# Altium schematic sheet OSV-OL_MOT-DRIV.SchDoc
size A3
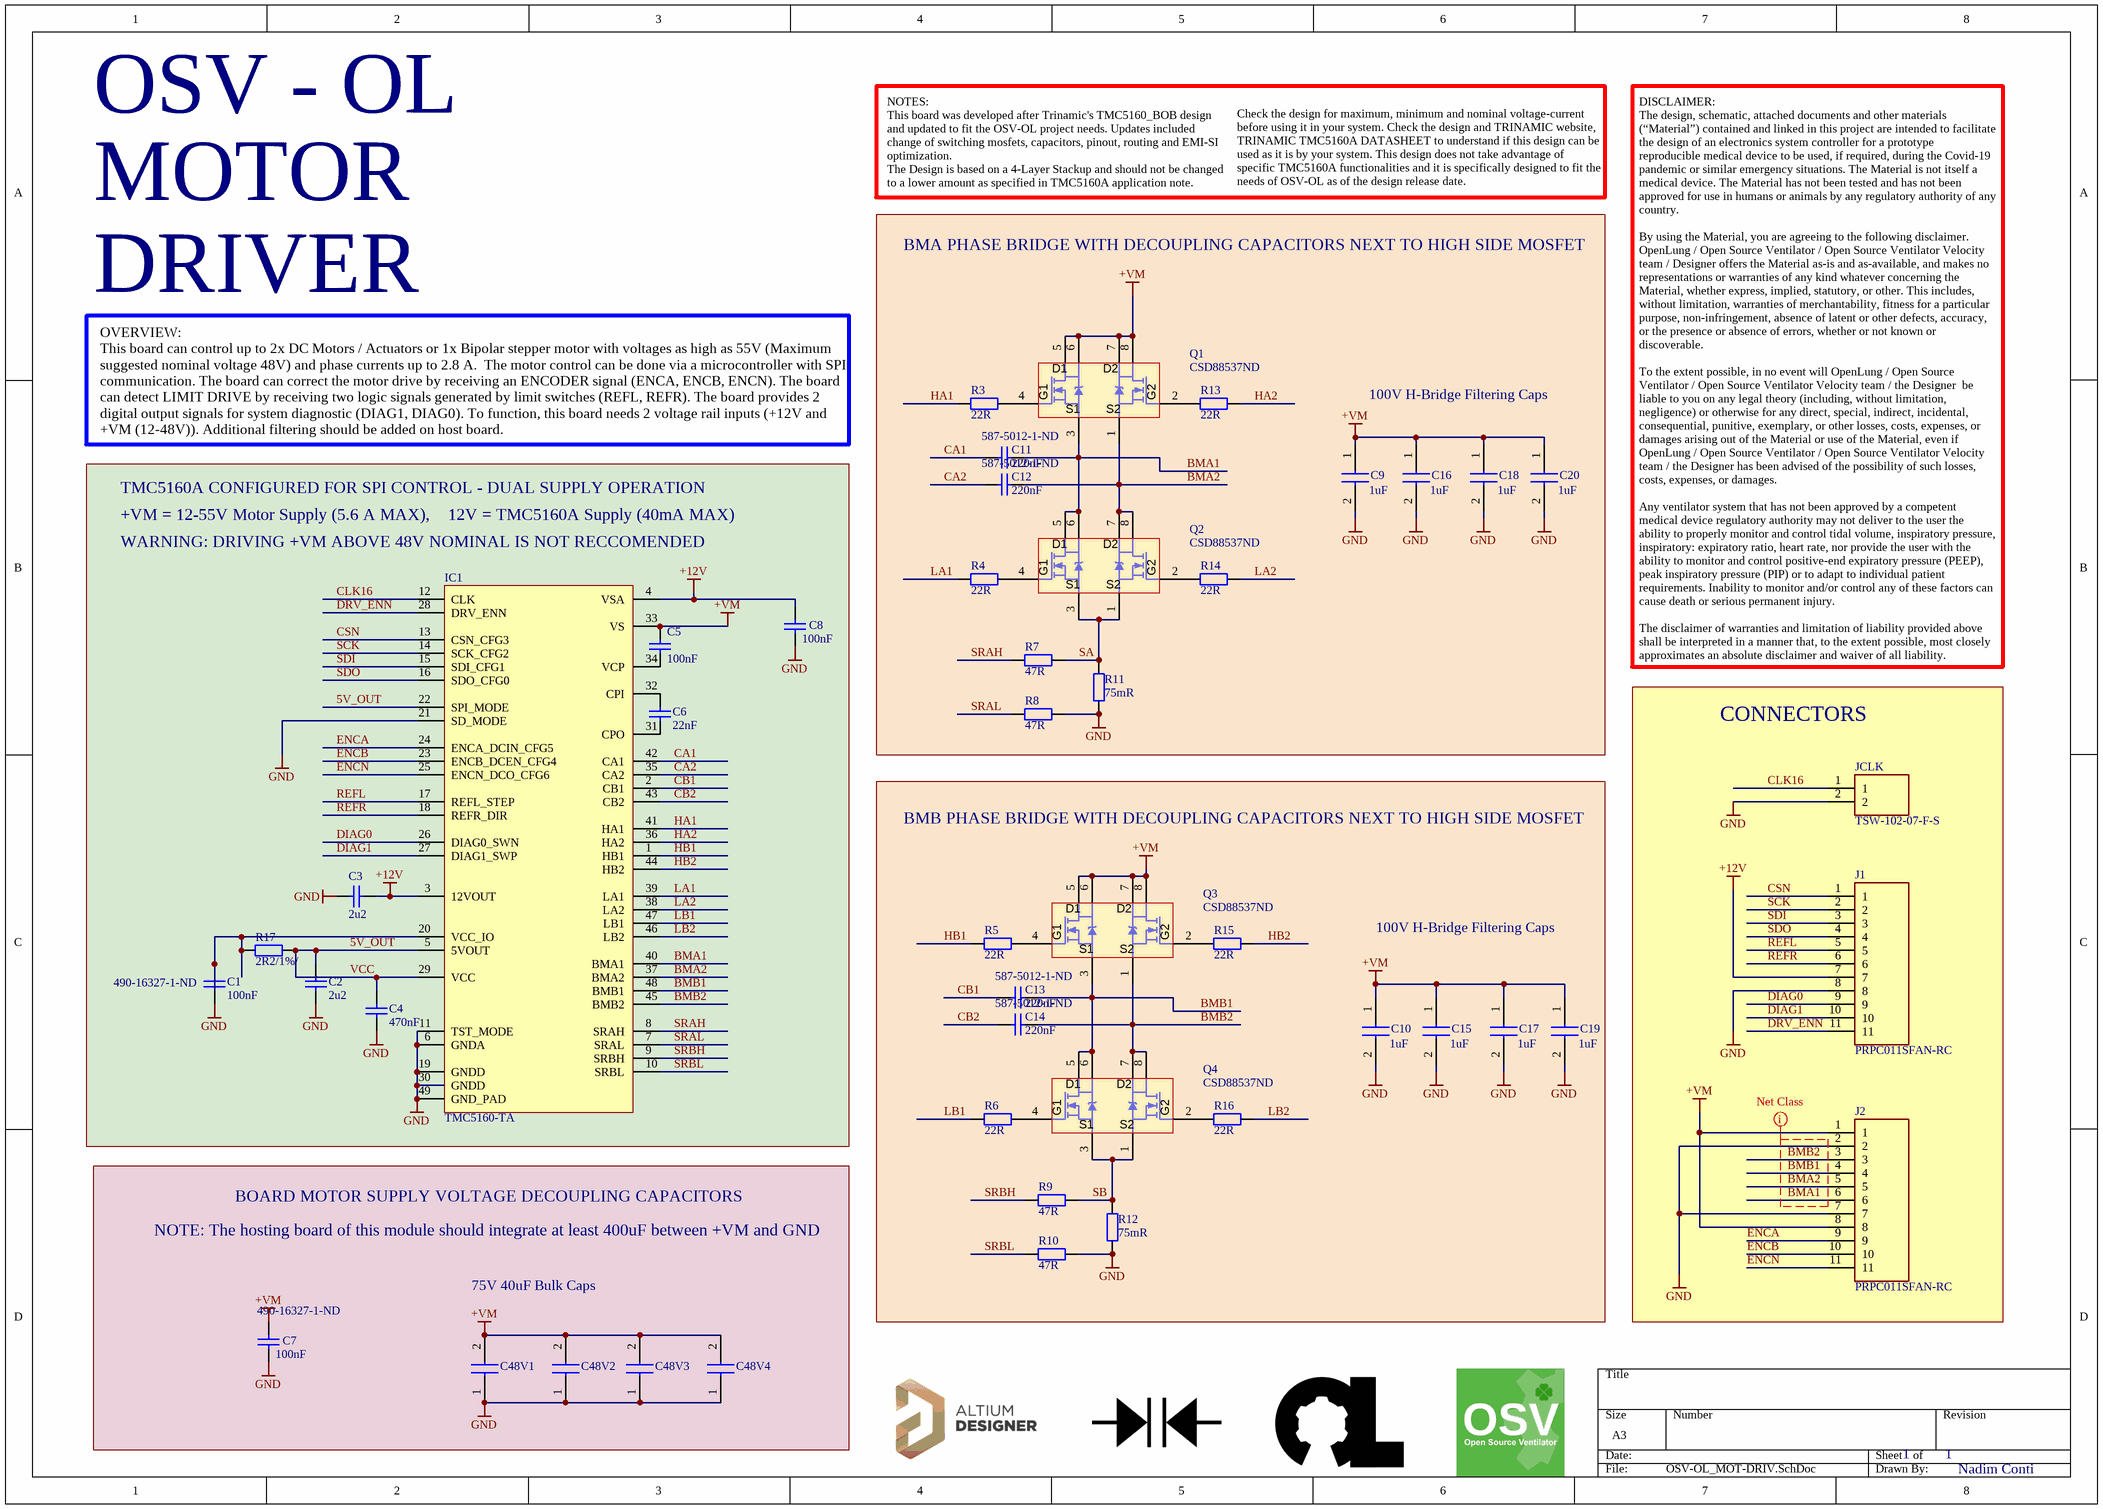
[diagram p0: OSV-OL_MOT-DRIV.SchDoc]

## Parts
C1  100nF  Supplier Part Number 1: 490-16327-1-ND  [C0603]
C2  2u2  [C0603]
C3  2u2  [C0603]
C4  470nF  [C0603]
C5  100nF  [C0603]
C6  22nF  [C0603]
C7  100nF  Supplier Part Number 1: 490-16327-1-ND  [C0603]
C8  100nF  [C0603]
C9  value 1uF  [CAPC2012X145N]  (hidden comment: GRM21BC72A105KE01L)
C10  value 1uF  [CAPC2012X145N]  (hidden comment: GRM21BC72A105KE01L)
C11  220nF  Supplier Part Number 1: 587-5012-1-ND  [C0402]
C12  220nF  Supplier Part Number 1: 587-5012-1-ND  [C0402]
C13  220nF  Supplier Part Number 1: 587-5012-1-ND  [C0402]
C14  220nF  Supplier Part Number 1: 587-5012-1-ND  [C0402]
C15  value 1uF  [CAPC2012X145N]  (hidden comment: GRM21BC72A105KE01L)
C16  value 1uF  [CAPC2012X145N]  (hidden comment: GRM21BC72A105KE01L)
C17  value 1uF  [CAPC2012X145N]  (hidden comment: GRM21BC72A105KE01L)
C18  value 1uF  [CAPC2012X145N]  (hidden comment: GRM21BC72A105KE01L)
C19  value 1uF  [CAPC2012X145N]  (hidden comment: GRM21BC72A105KE01L)
C20  value 1uF  [CAPC2012X145N]  (hidden comment: GRM21BC72A105KE01L)
C48V1  C3225X7R1N106K250AC  [CAPC3225X230N]  (value not drawn)
C48V2  C3225X7R1N106K250AC  [CAPC3225X230N]  (value not drawn)
C48V3  C3225X7R1N106K250AC  [CAPC3225X230N]  (value not drawn)
C48V4  C3225X7R1N106K250AC  [CAPC3225X230N]  (value not drawn)
IC1  TMC5160-TA  [TMC5160_TSQFP50P900X900X120_HS-49L]
J1  PRPC011SFAN-RC  [HDRV11W64P254_1X11_2794X254X1058P]
J2  PRPC011SFAN-RC  [HDRV11W64P254_1X11_2794X254X1058P]
JCLK  TSW-102-07-F-S  [HDRV2W64P254_1X2_508X241X838P]
Q1  CSD88537ND  [SOP127P600X170-8L]
Q2  CSD88537ND  [SOP127P600X170-8L]
Q3  CSD88537ND  [SOP127P600X170-8L]
Q4  CSD88537ND  [SOP127P600X170-8L]
R3  Resistance: 22R  [R0603]  (hidden comment: 22R / 100mW / 1%)
R4  Resistance: 22R  [R0603]  (hidden comment: 22R / 100mW / 1%)
R5  Resistance: 22R  [R0603]  (hidden comment: 22R / 100mW / 1%)
R6  Resistance: 22R  [R0603]  (hidden comment: 22R / 100mW / 1%)
R7  Resistance: 47R  [R0603]  (hidden comment: 47R /  / 1%)
R8  Resistance: 47R  [R0603]  (hidden comment: 47R /  / 1%)
R9  Resistance: 47R  [R0603]  (hidden comment: 47R /  / 1%)
R10  Resistance: 47R  [R0603]  (hidden comment: 47R /  / 1%)
R11  75mR  [R1206]
R12  75mR  [R1206]
R13  Resistance: 22R  [R0603]  (hidden comment: 22R / 100mW / 1%)
R14  Resistance: 22R  [R0603]  (hidden comment: 22R / 100mW / 1%)
R15  Resistance: 22R  [R0603]  (hidden comment: 22R / 100mW / 1%)
R16  Resistance: 22R  [R0603]  (hidden comment: 22R / 100mW / 1%)
R17  2R2/1%/  [R0603]

## Blocks framed on the sheet
100V H-Bridge Filtering Caps: C9 C11 C12 C16 C18 C20 Q1 Q2 R3 R4 R7 R8 R11 R13 R14
CONNECTORS: J1 J2 JCLK
100V H-Bridge Filtering Caps: C10 C13-C15 C17 C19 Q3 Q4 R5 R6 R9 R10 R12 R15 R16
BOARD MOTOR SUPPLY VOLTAGE DECOUPLING CAPACITORS: C7 C48V1-C48V4

## Nets
+12V: C3.2 C8.1 IC1.3(12VOUT) IC1.4(VSA) J1.7
+VM: C5.1 C7.1 C9.1 C10.1 C15.1 C16.1 C17.1 C18.1 C19.1 C20.1 C48V1.2 C48V2.2 C48V3.2 C48V4.2 IC1.33(VS) J2.1 J2.8 Q1.5(D1) Q1.6(D1) Q1.7(D2) Q1.8(D2) Q3.5(D1) Q3.6(D1) Q3.7(D2) Q3.8(D2)
GND: C1.2 C2.2 C3.1 C4.2 C7.2 C8.2 C9.2 C10.2 C15.2 C16.2 C17.2 C18.2 C19.2 C20.2 C48V1.1 C48V2.1 C48V3.1 C48V4.1 IC1.6(GNDA) IC1.11(TST_MODE) IC1.19(GNDD) IC1.21(SD_MODE) IC1.30(GNDD) IC1.49(GND_PAD) J1.8 J2.2 J2.7 JCLK.2 R8.1 R10.1 R11.2 R12.2
5V_OUT: C2.1 C4.1 IC1.5(5VOUT) IC1.22(SPI_MODE) IC1.29(VCC) R17.2  [also labelled VCC]
BMA1: C11.2 IC1.40(BMA1) J2.6 Q1.3(S1) Q2.5(D1) Q2.6(D1)
BMA2: C12.2 IC1.37(BMA2) J2.5 Q1.1(S2) Q2.7(D2) Q2.8(D2)
BMB1: C13.2 IC1.48(BMB1) J2.4 Q3.3(S1) Q4.5(D1) Q4.6(D1)
BMB2: C14.2 IC1.45(BMB2) J2.3 Q3.1(S2) Q4.7(D2) Q4.8(D2)
CA1: C11.1 IC1.42(CA1)
CA2: C12.1 IC1.35(CA2)
CB1: C13.1 IC1.2(CB1)
CB2: C14.1 IC1.43(CB2)
CLK16: IC1.12(CLK) JCLK.1
CSN: IC1.13(CSN_CFG3) J1.1
DIAG0: IC1.26(DIAG0_SWN) J1.9
DIAG1: IC1.27(DIAG1_SWP) J1.10
DRV_ENN: IC1.28(DRV_ENN) J1.11
ENCA: IC1.24(ENCA_DCIN_CFG5) J2.9
ENCB: IC1.23(ENCB_DCEN_CFG4) J2.10
ENCN: IC1.25(ENCN_DCO_CFG6) J2.11
HA1: IC1.41(HA1) R3.2
HA2: IC1.36(HA2) R13.1
HB1: IC1.1(HB1) R5.2
HB2: IC1.44(HB2) R15.1
LA1: IC1.39(LA1) R4.2
LA2: IC1.38(LA2) R14.1
LB1: IC1.47(LB1) R6.2
LB2: IC1.46(LB2) R16.1
REFL: IC1.17(REFL_STEP) J1.5
REFR: IC1.18(REFR_DIR) J1.6
SA: Q2.1(S2) Q2.3(S1) R7.1 R11.1
SB: Q4.1(S2) Q4.3(S1) R9.1 R12.1
SCK: IC1.14(SCK_CFG2) J1.2
SDI: IC1.15(SDI_CFG1) J1.3
SDO: IC1.16(SDO_CFG0) J1.4
SRAH: IC1.8(SRAH) R7.2
SRAL: IC1.7(SRAL) R8.2
SRBH: IC1.9(SRBH) R9.2
SRBL: IC1.10(SRBL) R10.2
NetC1_1: C1.1 IC1.20(VCC_IO) R17.1
NetC5_2: C5.2 IC1.34(VCP)
NetC6_1: C6.1 IC1.31(CPO)
NetC6_2: C6.2 IC1.32(CPI)
NetQ1_2: Q1.2(G2) R13.2
NetQ1_4: Q1.4(G1) R3.1
NetQ2_2: Q2.2(G2) R14.2
NetQ2_4: Q2.4(G1) R4.1
NetQ3_2: Q3.2(G2) R15.2
NetQ3_4: Q3.4(G1) R5.1
NetQ4_2: Q4.2(G2) R16.2
NetQ4_4: Q4.4(G1) R6.1

## Layout directives
net class MotorPowerOut: BMA1, BMA2, BMB1, BMB2

## Notes on the sheet
- OSV - OL
- MOTOR
- NOTES:
  This board was developed after Trinamic's TMC5160_BOB design and updated to fit the OSV-OL project needs. Updates included change of switching mosfets, capacitors, pinout, routing and EMI-SI optimization.
  The Design is based on a 4-Layer Stackup and should not be changed to a lower amount as specified in TMC5160A application note.
- Check the design for maximum, minimum and nominal voltage-current before using it in your system. Check the design and TRINAMIC website, TRINAMIC TMC5160A DATASHEET to understand if this design can be used as it is by your system. This design does not take advantage of specific TMC5160A functionalities and it is specifically designed to fit the needs of OSV-OL as of the design release date.
- DRIVER
- BMA PHASE BRIDGE WITH DECOUPLING CAPACITORS NEXT TO HIGH SIDE MOSFET
- OVERVIEW:
  This board can control up to 2x DC Motors / Actuators or 1x Bipolar stepper motor with voltages as high as 55V (Maximum suggested nominal voltage 48V) and phase currents up to 2.8 A.  The motor control can be done via a microcontroller with SPI communication. The board can correct the motor drive by receiving an ENCODER signal (ENCA, ENCB, ENCN). The board can detect LIMIT DRIVE by receiving two logic signals generated by limit switches (REFL, REFR). The board provides 2 digital output signals for system diagnostic (DIAG1, DIAG0). To function, this board needs 2 voltage rail inputs (+12V and +VM (12-48V)). Additional filtering should be added on host board.
- TMC5160A CONFIGURED FOR SPI CONTROL - DUAL SUPPLY OPERATION
- +VM = 12-55V Motor Supply (5.6 A MAX),    12V = TMC5160A Supply (40mA MAX)
- (near IC1) WARNING: DRIVING +VM ABOVE 48V NOMINAL IS NOT RECCOMENDED
- DISCLAIMER:
  The design, schematic, attached documents and other materials (“Material”) contained and linked in this project are intended to facilitate the design of an electronics system controller for a prototype reproducible medical device to be used, if required, during the Covid-19 pandemic or similar emergency situations. The Material is not itself a medical device. The Material has not been tested and has not been approved for use in humans or animals by any regulatory authority of any country.
  By using the Material, you are agreeing to the following disclaimer.
  OpenLung / Open Source Ventilator / Open Source Ventilator Velocity team / Designer offers the Material as-is and as-available, and makes no representations or warranties of any kind whatever concerning the Material, whether express, implied, statutory, or other. This includes, without limitation, warranties of merchantability, fitness for a particular purpose, non-infringement, absence of latent or other defects, accuracy, or the presence or absence of errors, whether or not known or discoverable.
  To the extent possible, in no event will OpenLung / Open Source Ventilator / Open Source Ventilator Velocity team / the Designer  be liable to you on any legal theory (including, without limitation, negligence) or otherwise for any direct, special, indirect, incidental, consequential, punitive, exemplary, or other losses, costs, expenses, or damages arising out of the Material or use of the Material, even if OpenLung / Open Source Ventilator / Open Source Ventilator Velocity team / the Designer has been advised of the possibility of such losses, costs, expenses, or damages.
  Any ventilator system that has not been approved by a competent medical device regulatory authority may not deliver to the user the ability to properly monitor and control tidal volume, inspiratory pressure, inspiratory: expiratory ratio, heart rate, nor provide the user with the ability to monitor and control positive-end expiratory pressure (PEEP), peak inspiratory pressure (PIP) or to adapt to individual patient requirements. Inability to monitor and/or control any of these factors can cause death or serious permanent injury.
  The disclaimer of warranties and limitation of liability provided above shall be interpreted in a manner that, to the extent possible, most closely approximates an absolute disclaimer and waiver of all liability.
- BMB PHASE BRIDGE WITH DECOUPLING CAPACITORS NEXT TO HIGH SIDE MOSFET
- NOTE: The hosting board of this module should integrate at least 400uF between +VM and GND
- 75V 40uF Bulk Caps
- 1          1
- Nadim Conti

## Library data of the parts
C1 C7 C8 = Capacitor: Cap Ceramic 0.1uF 100V X7R 20% Pad SMD 0603 125C T/R; Manufacturer: Murata; Manufacturer Part Number: GRM188R72A104MA35D; ComponentLinknDescription: Datasheet; ComponentLinknURL: *; ComponentLink1URL: http://search.murata.co.jp/Ceramy/image/img/A01X/G101/ENG/GRM188R72A104MA35-01.pdf?src-supplier=Digi-Key; ComponentLink1Description: http://search.murata.co.jp/Ceramy/image/img/A01X/G101/ENG/GRM188R72A104MA35-01.pdf?src-supplier=Digi-Key; ComponentLink2URL: https://search.murata.co.jp/Ceramy/image/img/A01X/G101/ENG/GRM188R72A104MA35-01.pdf?src-supplier=Digi-Key; ComponentLink2Description: https://search.murata.co.jp/Ceramy/image/img/A01X/G101/ENG/GRM188R72A104MA35-01.pdf?src-supplier=Digi-Key; Supplier 1: Digi-Key; RoHS: No; Category: Ceramic Capacitors; Stock 1: 19921; Pricing 1: 1=0,28000, 10=0,19100, 100=0,09660, 500=0,06612, 1000=0,05849 (USD); Voltage Rating (DC): 100V; Dielectric: X7R; Tolerance: 20%; Capacitance: 100nF; Length: 1.6mm; Width: 800um; Thickness: 800um
  C8: Supplier Part Number 1: 490-16327-1-ND
C2 C3 = 2.2 µF, 25 V, ± 10%, X5R, GRM Series: SMD Multilayer Ceramic Capacitor, 0603 [1608 Metric], 2.2 µF, 25 V, ± 10%, X5R, GRM Series; MPN: GRM188R61E225KA12D; Type: MLCC; Voltage rating: 50V; ComponentLinknDescription: Datasheet; MF: MURATA; Characteristic: *; ComponentLinknURL: *; Capacitance: 2u2; Precision: 10%
C4 = Capacitor: Ceramic capacitor; MPN: MC0603X474K160CT; Type: MLCC; Voltage rating: 16V; ComponentLinknDescription: Datasheet; MF: Multicomp; Precision: 10%; Characteristic: *; ComponentLinknURL: *; Capacitance: 470nF
C5 = Capacitor: Cap Ceramic 0.1uF 100V X7R 20% Pad SMD 0603 125C T/R; Manufacturer: Murata; Manufacturer Part Number: GRM188R72A104MA35D; Type: MLCC; Supplier 1: Digi-Key; Supplier Part Number 1: 490-16327-1-ND; RoHS: No; Category: Ceramic Capacitors; Stock 1: 19921; Pricing 1: 1=0,28000, 10=0,19100, 100=0,09660, 500=0,06612, 1000=0,05849 (USD); Voltage Rating (DC): 100V; Dielectric: X7R; Tolerance: 20%; Capacitance: 100nF; Length: 1.6mm; Width: 800um; Thickness: 800um; ComponentLink1URL: http://search.murata.co.jp/Ceramy/image/img/A01X/G101/ENG/GRM188R72A104MA35-01.pdf?src-supplier=Digi-Key; ComponentLink1Description: http://search.murata.co.jp/Ceramy/image/img/A01X/G101/ENG/GRM188R72A104MA35-01.pdf?src-supplier=Digi-Key; ComponentLink2URL: https://search.murata.co.jp/Ceramy/image/img/A01X/G101/ENG/GRM188R72A104MA35-01.pdf?src-supplier=Digi-Key; ComponentLink2Description: https://search.murata.co.jp/Ceramy/image/img/A01X/G101/ENG/GRM188R72A104MA35-01.pdf?src-supplier=Digi-Key
C6 = Capacitor: Ceramic capacitor; MPN: MC0603B223K500CT; Type: MLCC; Voltage rating: 50V; ComponentLinknDescription: Datasheet; MF: Multicomp; Precision: 20%; Characteristic: *; ComponentLinknURL: *; Capacitance: 22nF
C9 C10 C15-C20 = GRM21BC72A105KE01L: Capacitor; Manufacturer_Name: Murata Electronics; Datasheet Link: https://psearch.en.murata.com/capacitor/product/GRM21BC72A105KE01%23.html; Height: 1.45mm; Manufacturer_Part_Number: GRM21BC72A105KE01L; Mouser Part Number: 81-GRM21BC72A105KE1L; Mouser Price/Stock: https://www.mouser.com/Search/Refine.aspx?Keyword=81-GRM21BC72A105KE1L
C11-C14 = 0.22 µF, 50 V, ± 10%, X7R: CAP CER 0.22UF 100V X7S 0603; Manufacturer: Taiyo Yuden; Manufacturer Part Number: HMK107C7224KAHTE; ComponentLinknDescription: Datasheet; Tolerance: 10%; ComponentLinknURL: *; Supplier 1: Digi-Key; RoHS: No; Category: Ceramic Capacitors; Stock 1: 24916; Pricing 1: 1=0,28000, 10=0,19300, 100=0,10960, 500=0,07738, 1000=0,06772 (USD); Mount: Surface Mount; Case/Package: 0603; Case Code (Imperial): 0603; Case Code (Metric): 1608; Min Operating Temperature: -55°C; Max Operating Temperature: 125°C; Packaging: Cut Tape; Capacitance: 220nF; Voltage Rating: 100V; Ratings: AEC-Q200; ComponentLink1URL: https://www.yuden.co.jp/productdata/catalog//mlcc11_hq_e.pdf?src-supplier=Digi-Key; ComponentLink1Description: https://www.yuden.co.jp/productdata/catalog//mlcc11_hq_e.pdf?src-supplier=Digi-Key; ComponentLink2URL: http://ds.yuden.co.jp/TYCOMPAS/ut/detail.do?productNo=HMK107C7224KAHTE&fileName=HMK107C7224KAHTE_SS&mode=specSheetDownload&src-supplier=Digi-Key; ComponentLink2Description: http://ds.yuden.co.jp/TYCOMPAS/ut/detail.do?productNo=HMK107C7224KAHTE&fileName=HMK107C7224KAHTE_SS&mode=specSheetDownload&src-supplier=Digi-Key
C48V1-C48V4 = C3225X7R1N106K250AC: Capacitor; Manufacturer_Name: TDK; Datasheet Link: https://product.tdk.com/info/en/catalog/datasheets/mlcc_commercial_midvoltage_en.pdf; Height: 2.3mm; Manufacturer_Part_Number: C3225X7R1N106K250AC; Mouser Part Number: 810-C3225X7R1N106K25; Mouser Price/Stock: https://www.mouser.com/Search/Refine.aspx?Keyword=810-C3225X7R1N106K25
IC1 = TMC5160-TA: Manufacturer: TRINAMIC; Geometry.Height: 1,2mm; Distributor#1: Digikey; Distributor#2: *; MPN: TMC5160-TA; MF: TRINAMIC
J1 J2 = PRPC011SFAN-RC: Connector; Manufacturer_Name: Sullins; Datasheet Link: https://media.digikey.com/PDF/Data%20Sheets/Sullins%20PDFs/xRxCzzzSxxN-RC_ST_11635-B.pdf; Height: 10.58mm; Manufacturer_Part_Number: PRPC011SFAN-RC
JCLK = TSW-102-07-F-S: Connector; Manufacturer_Name: SAMTEC; Datasheet Link: http://suddendocs.samtec.com/catalog_english/tsw_th.pdf; Height: 8.38mm; Manufacturer_Part_Number: TSW-102-07-F-S; Mouser Part Number: 200-TSW10207FS; Mouser Price/Stock: https://www.mouser.com/Search/Refine.aspx?Keyword=200-TSW10207FS; RS Part Number: 1557967; RS Price/Stock: http://uk.rs-online.com/web/p/products/1557967
Q1-Q4 = CSD88537ND MOSFET 2N-CH 60V 15A 8SOIC: Mosfet Array 2 N-Channel (Dual) 60V 15A 2.1W Surface Mount 8-SOIC; MF: Texas Instruments; MPN: CSD88537ND
R3-R6 R13-R16 = 22 ohm, 50 V, 0603 [1608 Metric], 100 mW, ± 1%, MCWR Series: SMD Chip Resistor, Thick Film, 22 ohm, 50 V, 0603 [1608 Metric], 100 mW, ± 1%, MCWR Series; MPN: MCWR06X22R0FTLV; Temp coefficient: *ppm; MF: MULTICOMP; Precision: 1%; PowerRating: 100mW; Manufacturer: *; ComponentLinknURL: *
R7-R10 = 47 ohm, 75 V, 0603 [1608 Metric], 100 mW, ± 1%, MCSR 06 Series: SMD Chip Resistor, Ceramic, 47 ohm, 75 V, 0603 [1608 Metric], 100 mW, ± 1%, MCSR 06 Series; MPN: MCSR06X47R0FTL; Temp coefficient: *ppm; MF: MULTICOMP; Precision: 1%; Manufacturer: *; ComponentLinknURL: *
R11 R12 = R_SENS, 0.075 ohm, 1206, 1W, ± 1%, ERJ Series: SMD Chip Resistor, Thick Film, Current Sense Resistors - SMD 1W 0.075ohm 1%; MPN: ERJ-8BWFR075V; VoltageRating: 50V; Temp coefficient: *ppm; MF: Panasonic Electronic Components; Precision: 1%; PowerRating: 1W; Resistance: 75mR
R17 = Resistor: MPN: MC0063W060312R2; Precision: 1%; Voltage rating: *V; Temp coefficient: *ppm; Power rating: *mW; ComponentLinknDescription: Datasheet; Resistance: 2R2; MF: Multicomp; ComponentLinknURL: *